# Altium schematic sheet CW308_IMXRT1062.SchDoc: iMXRT1062 Microcontroller + SPI
size Letter; Organization: NewAE Technology Inc.; Address1: 1083 Queen St., Suite 196; Address2: Halifax; Address3: NS; Address4: Canada B3H 0B2; SheetNumber: 1; SheetTotal: 2; SheetApproved: NO
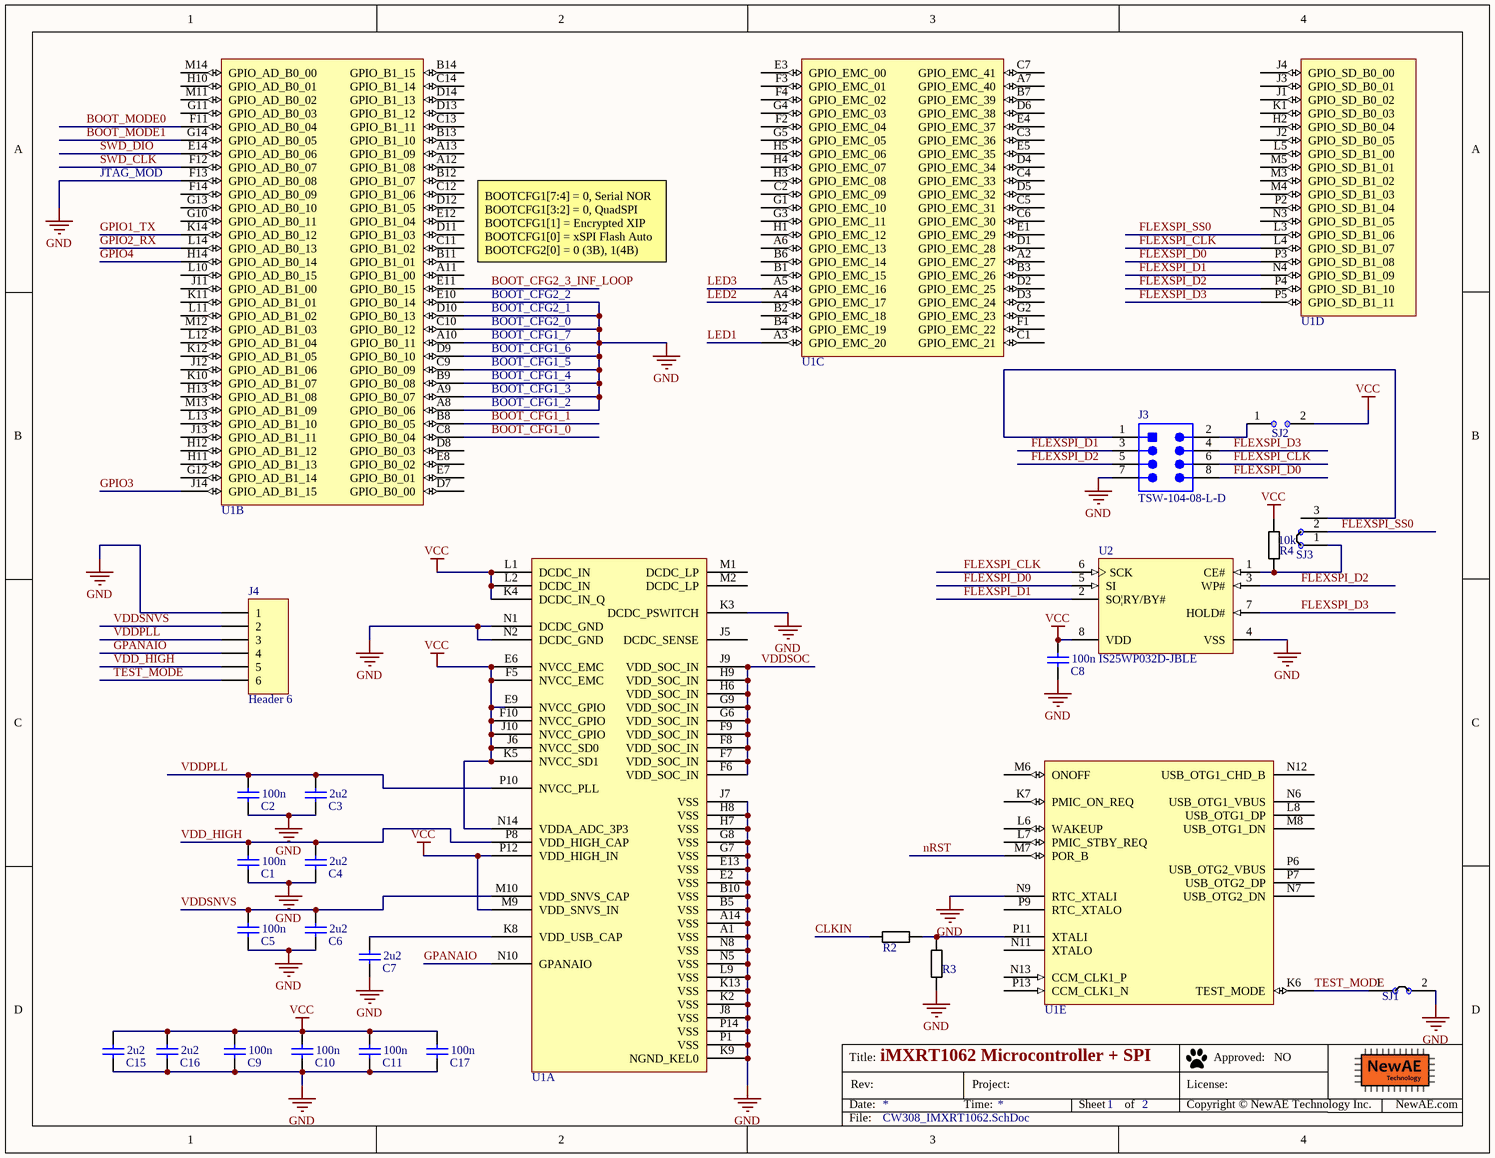
[diagram p0: CW308_IMXRT1062.SchDoc]

## Parts
C1  100n  [CAPC0603_M]
C2  100n  [CAPC0603_M]
C3  2u2  [CAPC0603_M]
C4  2u2  [CAPC0603_M]
C5  100n  [CAPC0603_M]
C6  2u2  [CAPC0603_M]
C7  2u2  [CAPC0603_M]
C8  100n  [CAPC0603_M]
C9  100n  [CAPC0603_M]
C10  100n  [CAPC0603_M]
C11  100n  [CAPC0603_M]
C15  2u2  [CAPC0603_M]
C16  2u2  [CAPC0603_M]
C17  100n  [CAPC0603_M]
J3  TSW-104-08-L-D  [SMTC-TSW-104-08-L-D_V]
J4  Header 6  [HDR1X6]
R2  100R  [RESC1608X55N]  (value not drawn)
R3  33R  [RESC1608X55N]  (value not drawn)
R4  10k  [RESC1608X55N]
SJ1  NC  [SJ_2S_NC]  (value not drawn)  (no BOM)
SJ2  NO  [SJ_2S_NO]  (value not drawn)  (no BOM)
SJ3  NC  [SJ_3S_NC12]  (value not drawn)  (no BOM)
U1  MIMXRT1062DVJ6A  [BGA196C80P14X14_1200X1200X161]  (value not drawn)  (parts A,B,C,D,E of 5)
U2  IS25WP032D-JBLE  [SOIC8_WIDE_NARROW]

## Nets
GND: C1.2 C2.2 C3.2 C4.2 C5.2 C6.2 C7.2 C8.2 C9.2 C10.2 C11.2 C15.2 C16.2 C17.2 J3.7 J4.1 R3.2 SJ1.2 U1.A1(VSS) U1.A8(GPIO_B0_06) U1.A9(GPIO_B0_07) U1.A10(GPIO_B0_11) U1.A14(VSS) U1.B5(VSS) U1.B9(GPIO_B0_08) U1.B10(VSS) U1.C9(GPIO_B0_09) U1.C10(GPIO_B0_12) U1.D9(GPIO_B0_10) U1.D10(GPIO_B0_13) U1.E2(VSS) U1.E10(GPIO_B0_14) U1.E13(VSS) U1.F13(GPIO_AD_B0_08) U1.G7(VSS) U1.G8(VSS) U1.H7(VSS) U1.H8(VSS) U1.J7(VSS) U1.J8(VSS) U1.K2(VSS) U1.K3(DCDC_PSWITCH) U1.K9(NGND_KEL0) U1.K13(VSS) U1.L9(VSS) U1.N1(DCDC_GND) U1.N2(DCDC_GND) U1.N5(VSS) U1.N8(VSS) U1.N9(RTC_XTALI) U1.P1(VSS) U1.P14(VSS) U2.4(VSS)
VCC: C8.1 C9.1 C10.1 C11.1 C15.1 C16.1 C17.1 R4.1 SJ2.2 U1.E6(NVCC_EMC) U1.E9(NVCC_GPIO) U1.F5(NVCC_EMC) U1.F10(NVCC_GPIO) U1.J6(NVCC_SD0) U1.J10(NVCC_GPIO) U1.K4(DCDC_IN_Q) U1.K5(NVCC_SD1) U1.L1(DCDC_IN) U1.L2(DCDC_IN) U1.M9(VDD_SNVS_IN) U1.N14(VDDA_ADC_3P3) U1.P12(VDD_HIGH_IN) U2.8(VDD)
BOOT_CFG1_0: U1.C8(GPIO_B0_04)
BOOT_CFG1_1: U1.B8(GPIO_B0_05)
BOOT_CFG2_3_INF_LOOP: U1.E11(GPIO_B0_15)
BOOT_MODE0: U1.F11(GPIO_AD_B0_04)
BOOT_MODE1: U1.G14(GPIO_AD_B0_05)
CLKIN: R2.1
FLEXSPI_CLK: J3.6 U1.L4(GPIO_SD_B1_07) U2.6(SCK)
FLEXSPI_D0: J3.8 U1.P3(GPIO_SD_B1_08) U2.5(SI)
FLEXSPI_D1: J3.3 U1.N4(GPIO_SD_B1_09) U2.2(SO|RY/BY#)
FLEXSPI_D2: J3.5 U1.P4(GPIO_SD_B1_10) U2.3(WP#)
FLEXSPI_D3: J3.4 U1.P5(GPIO_SD_B1_11) U2.7(HOLD#)
FLEXSPI_SS0: SJ3.2 U1.L3(GPIO_SD_B1_06)
GPANAIO: J4.4 U1.N10(GPANAIO)
GPIO1_TX: U1.K14(GPIO_AD_B0_12)
GPIO2_RX: U1.L14(GPIO_AD_B0_13)
GPIO3: U1.J14(GPIO_AD_B1_15)
GPIO4: U1.H14(GPIO_AD_B0_14)
LED1: U1.A3(GPIO_EMC_20)
LED2: U1.A4(GPIO_EMC_17)
LED3: U1.A5(GPIO_EMC_16)
nRST: U1.M7(POR_B)
SWD_CLK: U1.F12(GPIO_AD_B0_07)
SWD_DIO: U1.E14(GPIO_AD_B0_06)
TEST_MODE: J4.6 SJ1.1 U1.K6(TEST_MODE)
VDD_HIGH: C1.1 C4.1 J4.5 U1.P8(VDD_HIGH_CAP)
VDDPLL: C2.1 C3.1 J4.3 U1.P10(NVCC_PLL)
VDDSNVS: C5.1 C6.1 J4.2 U1.M10(VDD_SNVS_CAP)
VDDSOC: U1.F6(VDD_SOC_IN) U1.F7(VDD_SOC_IN) U1.F8(VDD_SOC_IN) U1.F9(VDD_SOC_IN) U1.G6(VDD_SOC_IN) U1.G9(VDD_SOC_IN) U1.H6(VDD_SOC_IN) U1.H9(VDD_SOC_IN) U1.J9(VDD_SOC_IN)
NetC7_1: C7.1 U1.K8(VDD_USB_CAP)
NetJ3_1: J3.1 SJ3.3
NetJ3_2: J3.2 SJ2.1
NetR2_2: R2.2 R3.1 U1.P11(XTALI)
NetR4_2: R4.2 SJ3.1 U2.1(CE#)

Not connected (* = marked no-connect by the designer): U1 A2(GPIO_EMC_27) A6(GPIO_EMC_13) A7(GPIO_EMC_40) A11(GPIO_B1_00) A12(GPIO_B1_08) A13(GPIO_B1_09) B1(GPIO_EMC_15) B2(GPIO_EMC_18) B3(GPIO_EMC_26) B4(GPIO_EMC_19) B6(GPIO_EMC_14) B7(GPIO_EMC_39) B11(GPIO_B1_01) B12(GPIO_B1_07) B13(GPIO_B1_10) B14(GPIO_B1_15) C1(GPIO_EMC_21) C2(GPIO_EMC_09) C3(GPIO_EMC_36) C4(GPIO_EMC_33) C5(GPIO_EMC_31) C6(GPIO_EMC_30) C7(GPIO_EMC_41) C11(GPIO_B1_02) C12(GPIO_B1_06) C13(GPIO_B1_11) C14(GPIO_B1_14) D1(GPIO_EMC_28) D2(GPIO_EMC_25) D3(GPIO_EMC_24) D4(GPIO_EMC_34) D5(GPIO_EMC_32) D6(GPIO_EMC_38) D7(GPIO_B0_00) D8(GPIO_B0_03) D11(GPIO_B1_03) D12(GPIO_B1_05) D13(GPIO_B1_12) D14(GPIO_B1_13) E1(GPIO_EMC_29) E3(GPIO_EMC_00) E4(GPIO_EMC_37) E5(GPIO_EMC_35) E7(GPIO_B0_01) E8(GPIO_B0_02) E12(GPIO_B1_04) F1(GPIO_EMC_22) F2(GPIO_EMC_04) F3(GPIO_EMC_01) F4(GPIO_EMC_02) F14(GPIO_AD_B0_09) G1(GPIO_EMC_10) G2(GPIO_EMC_23) G3(GPIO_EMC_11) G4(GPIO_EMC_03) G5(GPIO_EMC_05) G10(GPIO_AD_B0_11) G11(GPIO_AD_B0_03) G12(GPIO_AD_B1_14) G13(GPIO_AD_B0_10) H1(GPIO_EMC_12) H2(GPIO_SD_B0_04) H3(GPIO_EMC_08) H4(GPIO_EMC_07) H5(GPIO_EMC_06) H10(GPIO_AD_B0_01) H11(GPIO_AD_B1_13) H12(GPIO_AD_B1_12) H13(GPIO_AD_B1_08) J1(GPIO_SD_B0_02) J2(GPIO_SD_B0_05) J3(GPIO_SD_B0_01) J4(GPIO_SD_B0_00) J5(DCDC_SENSE) J11(GPIO_AD_B1_00) J12(GPIO_AD_B1_06) J13(GPIO_AD_B1_11) K1(GPIO_SD_B0_03) K7(PMIC_ON_REQ) K10(GPIO_AD_B1_07) K11(GPIO_AD_B1_01) K12(GPIO_AD_B1_05) L5(GPIO_SD_B1_00) L6(WAKEUP) L7(PMIC_STBY_REQ) L8(USB_OTG1_DP) L10(GPIO_AD_B0_15) L11(GPIO_AD_B1_02) L12(GPIO_AD_B1_04) L13(GPIO_AD_B1_10) M1(DCDC_LP) M2(DCDC_LP) M3(GPIO_SD_B1_02) M4(GPIO_SD_B1_03) M5(GPIO_SD_B1_01) M6(ONOFF) M8(USB_OTG1_DN) M11(GPIO_AD_B0_02) M12(GPIO_AD_B1_03) M13(GPIO_AD_B1_09) M14(GPIO_AD_B0_00) N3(GPIO_SD_B1_05) N6(USB_OTG1_VBUS) N7(USB_OTG2_DN) N11(XTALO) N12(USB_OTG1_CHD_B) N13(CCM_CLK1_P) P2(GPIO_SD_B1_04) P6(USB_OTG2_VBUS) P7(USB_OTG2_DP) P9(RTC_XTALO) P13(CCM_CLK1_N)

## Notes on the sheet
- JTAG_MOD
- BOOTCFG1[7:4] = 0, Serial NOR
  BOOTCFG1[3:2] = 0, QuadSPI
  BOOTCFG1[1] = Encrypted XIP
  BOOTCFG1[0] = xSPI Flash Auto
  BOOTCFG2[0] = 0 (3B), 1(4B)
- BOOT_CFG2_2
- BOOT_CFG2_1
- BOOT_CFG1_5
- BOOT_CFG1_6
- BOOT_CFG1_7
- BOOT_CFG2_0
- BOOT_CFG1_2
- BOOT_CFG1_3
- BOOT_CFG1_4
- Title:
- Date:
- Rev:
- Time:
- Project:
- Sheet
- of
- License:
- Copyright © NewAE Technology Inc.
- Approved:
- NewAE.com
- File:

## Library data of the parts
C1 C2 C5 C8-C11 C17 = CCHIP-100n-0603: 100n, 0603; Manufacture 1: Kemet; Manufacture Part Number 1: C0603C104K5RACTU; Component Group: Capacitor; Case-EIA: 0603; Case-Metric: 1608; Rated Voltage: 50VDC; Part Number: CCHIP-100n-0603; Footprint: 0603; Pin Count: 2; Supplier 1: Digi-Key; Supplier Part Number 1: 399-5089-2-ND; Value: 100n; Mounting Technology: SMT; Component Kind: Standard; Component Type: Standard
C3 C4 C6 C7 C15 C16 = CCHIP-2u2-0603: 2u2, 0603; Manufacture 1: Samsung; Manufacture Part Number 1: CL10B225KP8NNNC; Component Group: Capacitor; Case-EIA: 0603; Case-Metric: 1608; Rated Voltage: 10VDC; Part Number: CCHIP-2u2-0603; Footprint: 0603; Pin Count: 2; Supplier 1: Digi-Key; Supplier Part Number 1: 1276-1134-2-ND; Value: 2u2; Mounting Technology: SMT; Component Kind: Standard; Component Type: Standard
J3 = CMP-1681-00006-4: Male Header, Pitch 2.54 mm, 2 x 4 Position, Height 8.38 mm, Tail Length 5.08 mm, -55 to 125 degC, RoHS, Bulk; Manufacturer: Samtec; Voltage Rating: 550 V; Current Rating: 7.6 A; Rows: 2; ComponentLink2URL: https://datasheet.ciiva.com/25616/0900766b81154476-25616879.pdf; Package Quantity: 1; PackageDescription: Male Header, Pitch 2.54 mm, 2 x 4 Position, Height 8.38 mm, Tail Length 5.08 mm; ComponentLink1Description: Manufacturer URL; Lead Pitch: 0.1 inch; REACH SVHC: No SVHC; Mounting Technology: Through Hole; PackageReference: TSW-104-08-L-D; Contact Plating: Gold; DatasheetVersion: 04/2012; Colour: Black; Contact Finish: Gold; ComponentLink3URL: http://suddendocs.samtec.com/prints/tsw-xxx-xx-x-x-xx-xxx-footprint.pdf; ComponentLink3Description: Package Specification; Mount: Through Hole; RoHSCompliant: true; Packaging: Bulk; ComponentLink2Description: Datasheet; Contact Material: Bronze; Pins: 8; ComponentLink1URL: http://www.samtec.com/
J4 = Header 6: Header, 6-Pin; LatestRevisionDate: 17-Jul-2002; LatestRevisionNote: Re-released for DXP Platform.; Publisher: Altium Limited
R2 = RCHIP-100R-0603: 100R res, 0603, 1%, 1/10W; Manufacture 1: Yageo; Manufacture Part Number 1: RC0603FR-07100RL; Component Group: Resistor; Case-EIA: 0603; Case-Metric: 1608; Rated Power: 0.1W; Rated Voltage: 75VDC; Part Number: RCHIP-100R-0603; Footprint: 0603; Pin Count: 2; Supplier 1: Digi-Key; Supplier Part Number 1: 311-100HRCT-ND; Value: 100R; Tolerance: 1%; Mounting Technology: SMT; Temperature Range: -55C to 155C; Component Kind: Standard; Component Type: Standard
R3 = RCHIP-33R-0603: 33R res, 0603, 1%, 1/10W; Manufacture 1: Yageo; Manufacture Part Number 1: RC0603FR-0733RL; Component Group: Resistor; Case-EIA: 0603; Case-Metric: 1608; Rated Power: 0.1W; Rated Voltage: 75VDC; Part Number: RCHIP-33R-0603; Footprint: 0603; Pin Count: 2; Supplier 1: Digi-Key; Supplier Part Number 1: 311-33.0HRCT-ND; Value: 33R; Tolerance: 1%; Mounting Technology: SMT; Temperature Range: -55C to 155C; Component Kind: Standard; Component Type: Standard
R4 = RCHIP-10K-0603: 10k res, 0603, 1%, 1/10W; Manufacture 1: Yageo; Manufacture Part Number 1: RC0603FR-0710KL; Component Group: Resistor; Case-EIA: 0603; Case-Metric: 1608; Rated Power: 0.1W; Rated Voltage: 75VDC; Part Number: RCHIP-10K-0603; Footprint: 0603; Pin Count: 2; Supplier 1: Digi-Key; Supplier Part Number 1: 311-10.0KHRCT-ND; Value: 10k; Tolerance: 1%; Mounting Technology: SMT; Temperature Range: -55C to 155C; Component Kind: Standard; Component Type: Standard
SJ1 = SJ_2S: Solder Jumper, NC; Component Group: PCB Feature; Part Number: SJ_2S; Pin Count: 2; Mounting Technology: COPPER; Component Type: Standard (No BOM)
SJ2 = SJ_2S_NO: Solder Jumper, NO; Component Group: PCB Feature; Part Number: SJ_2S_NO; Pin Count: 2; Mounting Technology: COPPER; Component Type: Standard (No BOM)
SJ3 = SJ_3S_12JMP: Solder Jumper, NC; Component Group: PCB Feature; Part Number: SJ_3S_12JMP; Pin Count: 3; Mounting Technology: COPPER; Component Type: Standard (No BOM)
U1 = MIMXRT1062DVJ6A: NXP Cross-Over iMX Microcontroller; Component Group: Digital IC; PP Material Stack: 0; Part Number: MIMXRT1062DVJ6A; Footprint: BGA196 12x12; Manufacture 1: NXP; Manufacture Part Number 1: MIMXRT1062DVJ6A; Pin Count: 196; Supplier 1: Digi-Key; Supplier Part Number 1: 568-15307-ND; Mounting Technology: SMT; RoHS: Yes; Component Kind: Standard; Component Type: Standard; PP Rotation: 0
U2 = IS25WP032D-JBLE: 32MB QPI/QPI/QSPI 8-PIN SOP 208M; Manufacture 1: ISSI; Component Group: Digital IC; Pitch: 1.27mm; Part Number: IS25WP032D-JBLE; Component Kind: Standard; Component Type: Standard; Footprint: SOIC8_WIDE; Manufacture Part Number 1: IS25WP032D-JBLE; Pin Count: 8; Supplier 1: Digi-Key; Supplier Part Number 1: 706-1615-ND; Mounting Technology: SMT; RoHS: Yes